# Altium schematic sheet BV100011_ControlQSPI.SchDoc
size A4
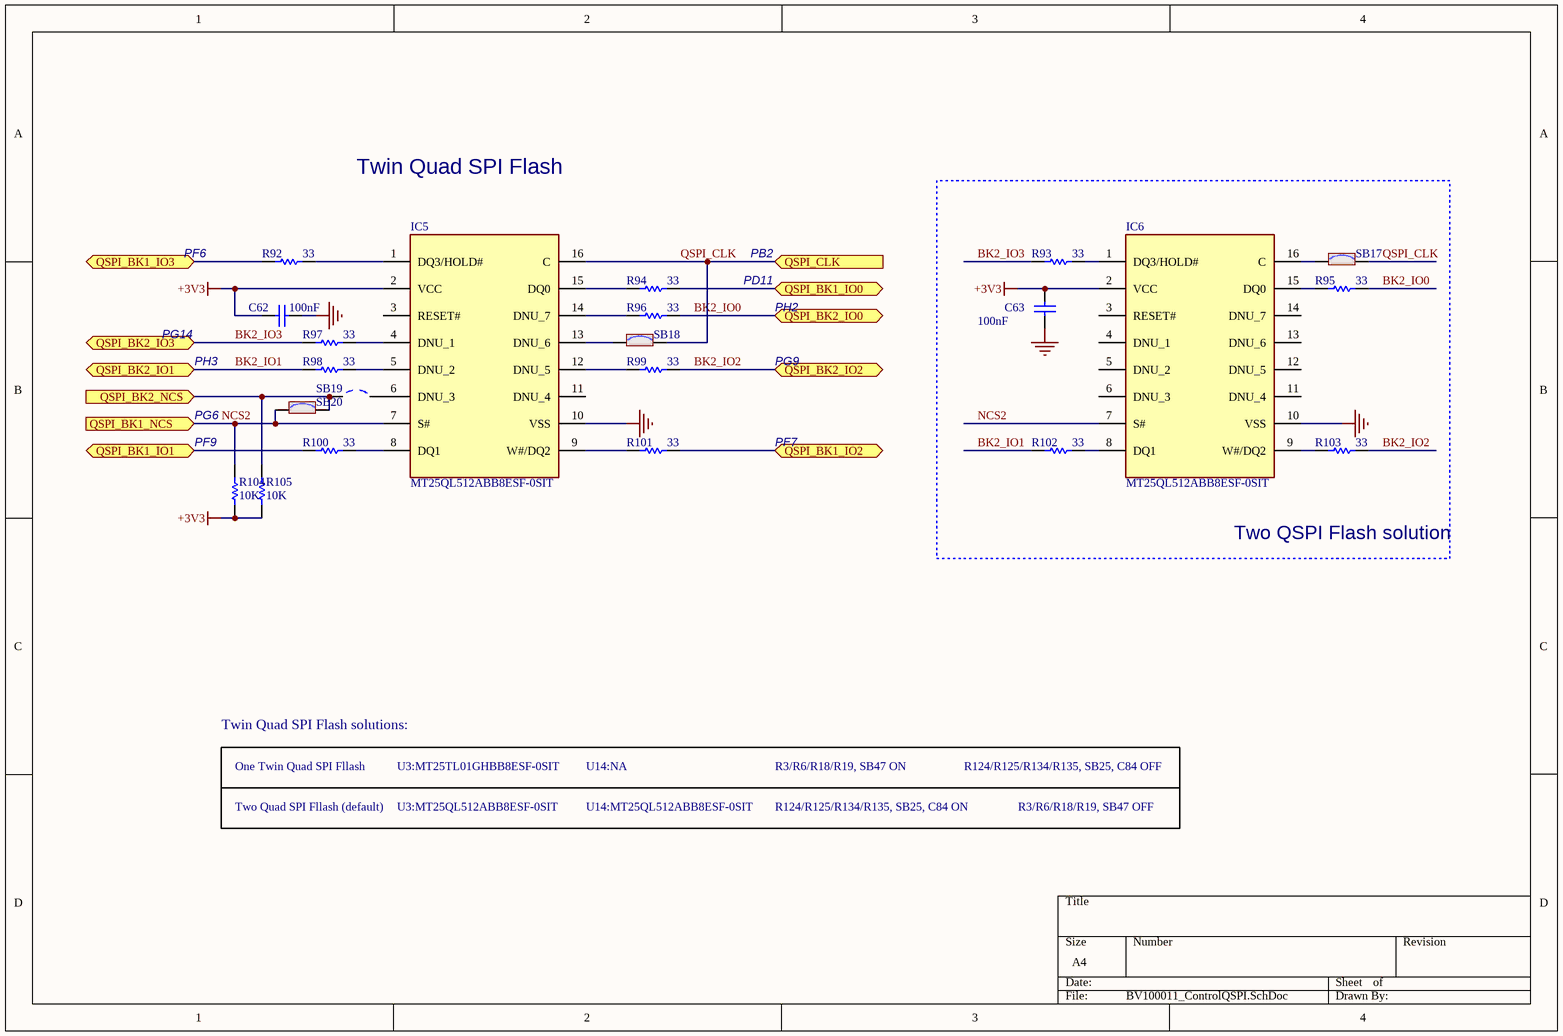
[diagram p0: BV100011_ControlQSPI.SchDoc]

## Parts
C62  100nF  [C0402]
C63  100nF  [C0402]
IC5  MT25QL512ABB8ESF-0SIT  [SOIC127P1032X265-16N]
IC6  MT25QL512ABB8ESF-0SIT  [SOIC127P1032X265-16N]
R92  33  [R0402]
R93  33  [R0402]
R94  33  [R0402]
R95  33  [R0402]
R96  33  [R0402]
R97  33  [R0402]
R98  33  [R0402]
R99  33  [R0402]
R100  33  [R0402]
R101  33  [R0402]
R102  33  [R0402]
R103  33  [R0402]
R104  value 10K  [R0402]  (hidden comment: Resistor)
R105  value 10K  [R0402]  (hidden comment: Resistor)
SB17  Solder Bridge ON  [SB_0603]  (value not drawn)
SB18  Solder Bridge ON  [SB_0603]  (value not drawn)
SB19  Solder Bridge OFF  [SB_0603]  (value not drawn)
SB20  Solder Bridge ON  [SB_0603]  (value not drawn)

## Blocks framed on the sheet
Two QSPI Flash solution: C63 IC6 R93 R95 R102 R103 SB17

## Ports
QSPI_BK1_IO0 (bidir), QSPI_BK1_IO1 (bidir), QSPI_BK1_IO2 (bidir), QSPI_BK1_IO3 (bidir), QSPI_BK1_NCS (in), QSPI_BK2_IO0 (bidir), QSPI_BK2_IO1 (bidir), QSPI_BK2_IO2 (bidir), QSPI_BK2_IO3 (bidir), QSPI_BK2_NCS (in), QSPI_CLK (in)

## Nets
+3V3: C62.1 C63.1 IC5.2(VCC) IC6.2(VCC) R104.1 R105.1
GND: C62.2 C63.2 IC5.10(VSS) IC6.10(VSS)
BK2_IO0: R95.1 R96.1 ; port QSPI_BK2_IO0
BK2_IO1: R98.2 R102.2 ; port QSPI_BK2_IO1
BK2_IO2: R99.1 R103.1 ; port QSPI_BK2_IO2
BK2_IO3: R93.2 R97.2 ; port QSPI_BK2_IO3
NCS2: IC5.7(S#) IC6.7(S#) R104.2 SB20.1 ; port QSPI_BK1_NCS
QSPI_BK1_IO0: R94.1 ; port QSPI_BK1_IO0
QSPI_BK1_IO1: R100.2 ; port QSPI_BK1_IO1
QSPI_BK1_IO2: R101.1 ; port QSPI_BK1_IO2
QSPI_BK1_IO3: R92.2 ; port QSPI_BK1_IO3
QSPI_BK2_NCS: R105.2 SB19.1 SB20.2 ; port QSPI_BK2_NCS
QSPI_CLK: IC5.16(C) SB17.2 SB18.2 ; port QSPI_CLK
NetIC5_1: IC5.1(DQ3/HOLD#) R92.1
NetIC5_4: IC5.4(DNU_1) R97.1
NetIC5_5: IC5.5(DNU_2) R98.1
NetIC5_6: IC5.6(DNU_3) SB19.2
NetIC5_8: IC5.8(DQ1) R100.1
NetIC5_9: IC5.9(W#/DQ2) R101.2
NetIC5_12: IC5.12(DNU_5) R99.2
NetIC5_13: IC5.13(DNU_6) SB18.1
NetIC5_14: IC5.14(DNU_7) R96.2
NetIC5_15: IC5.15(DQ0) R94.2
NetIC6_1: IC6.1(DQ3/HOLD#) R93.1
NetIC6_8: IC6.8(DQ1) R102.1
NetIC6_9: IC6.9(W#/DQ2) R103.2
NetIC6_15: IC6.15(DQ0) R95.2
NetIC6_16: IC6.16(C) SB17.1

Not connected (* = marked no-connect by the designer): IC5 3(RESET#) 11(DNU_4); IC6 3(RESET#) 4(DNU_1) 5(DNU_2) 6(DNU_3) 11(DNU_4) 12(DNU_5) 13(DNU_6) 14(DNU_7)

## Notes on the sheet
- Twin Quad SPI Flash
- PF6
- PD11
- PB2
- PH2
- PG14
- PH3
- PG9
- PF9
- PG6
- PF7
- Twin Quad SPI Flash solutions:
- One Twin Quad SPI Fllash
- U3:MT25TL01GHBB8ESF-0SIT
- U14:NA
- R3/R6/R18/R19, SB47 ON
- R124/R125/R134/R135, SB25, C84 OFF
- Two Quad SPI Fllash (default)
- U3:MT25QL512ABB8ESF-0SIT
- U14:MT25QL512ABB8ESF-0SIT
- R124/R125/R134/R135, SB25, C84 ON
- R3/R6/R18/R19, SB47 OFF

## Library data of the parts
C62 C63 = Cap: Capacitor; Value: 10nF; Ordered by: Subcon; Published: 8-Jun-2000; Revision: July-2002: Re-released for DXP Platform.; Publisher: Altium Limited
IC5 IC6 = MT25QL512ABB8ESF-0SIT: Integrated Circuit; Manufacturer_Name: Micron; Datasheet Link: https://www.micron.com/~/media/documents/products/data-sheet/nor-flash/serial-nor/mt25q/die-rev-b/mt25q_qlkt_l_512_abb_0.pdf; Height: 2.65mm; Manufacturer_Part_Number: MT25QL512ABB8ESF-0SIT; Mouser Part Number: 340-278183-TRAY; Mouser Price/Stock: https://www.mouser.com/Search/Refine.aspx?Keyword=340-278183-TRAY
R92-R103 = Res1: Resistor; Value: 1K; Published: 8-Jun-2000; Revision: July-2002: Re-released for DXP Platform.; Publisher: Altium Limited
R104 R105 = MCD-00053: Resistor,10K,0402,1%,1/16W; Manufacturer_Part_Number: RC0402FR-0710KL; Manufacturer: YAGEO; Provided_By: subcon; Initial_Board_Reference: MB1274; Internal_Part_Number: MCD-00053; Status: Released; Part_Type: Resistor; Package: R0402; ComponentLink1Description: Yageo_Resistor_RC0402-series.pdf; ComponentLink1URL: http://tunmcdsvn.tun.st.com/Component_Datasheet_Library/Trunk/Resistors/Yageo_Resistor_RC0402-series; ECCN_US: n/a; ECCN_EU: n/a
SB17 SB18 SB20 = SB_ON: Fitted: YES; Ordered by: Subcon; Revision: July-2002: Re-released for DXP Platform.; ECCN_US/EU: n/a
SB19 = SB_OFF: Fitted: NO; Ordered by: Subcon; Revision: July-2002: Re-released for DXP Platform.; ECCN_US/EU: n/a